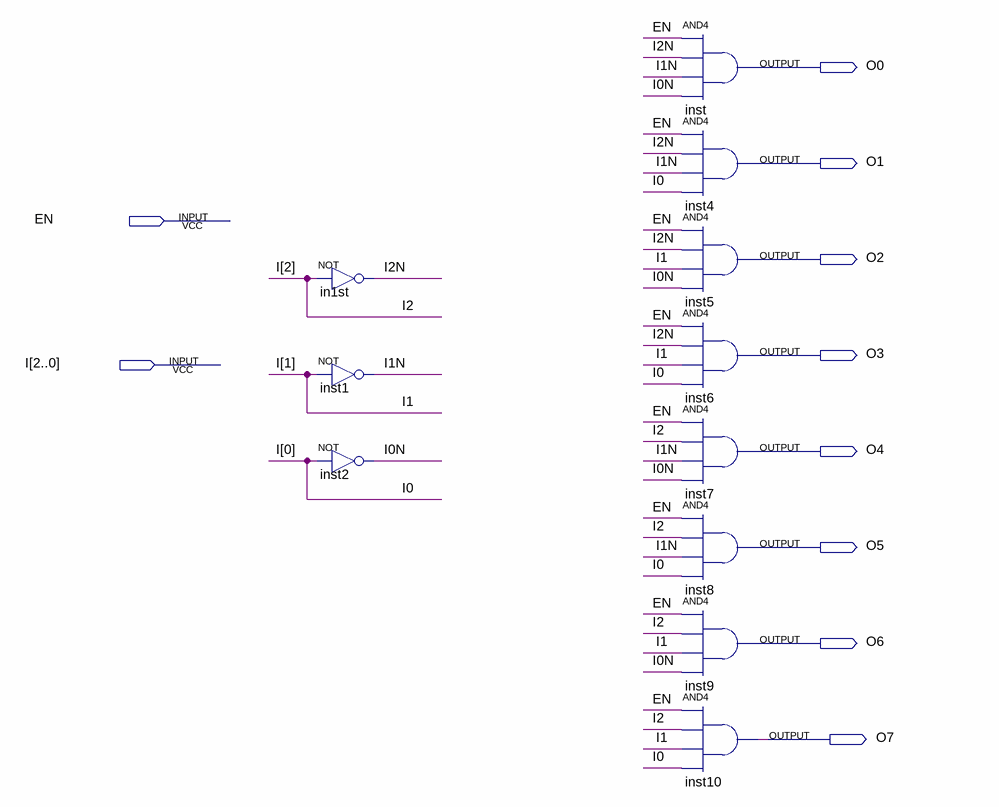
[diagram p0: schematic sheet]
// Quartus schematic DECODE38.bdf as structural Verilog: 11 symbols, 10 pins
module DECODE38 (
  input  EN,
  input  [2:0] I,
  output O0,
  output O1,
  output O2,
  output O3,
  output O4,
  output O5,
  output O6,
  output O7
);

  wire I0N, I1N, I2N;

  not in1st (I2N, I[2]);
  not inst1 (I1N, I[1]);
  not inst2 (I0N, I[0]);
  and inst (O0, EN, I2N, I1N, I0N);
  and inst4 (O1, EN, I2N, I1N, I[0]);
  and inst5 (O2, EN, I2N, I[1], I0N);
  and inst6 (O3, EN, I2N, I[1], I[0]);
  and inst7 (O4, EN, I[2], I1N, I0N);
  and inst8 (O5, EN, I[2], I1N, I[0]);
  and inst9 (O6, EN, I[2], I[1], I0N);
  and inst10 (O7, EN, I[2], I[1], I[0]);
endmodule
